# Altium schematic sheet waku-ctl.SchDoc (part 2 of 4)
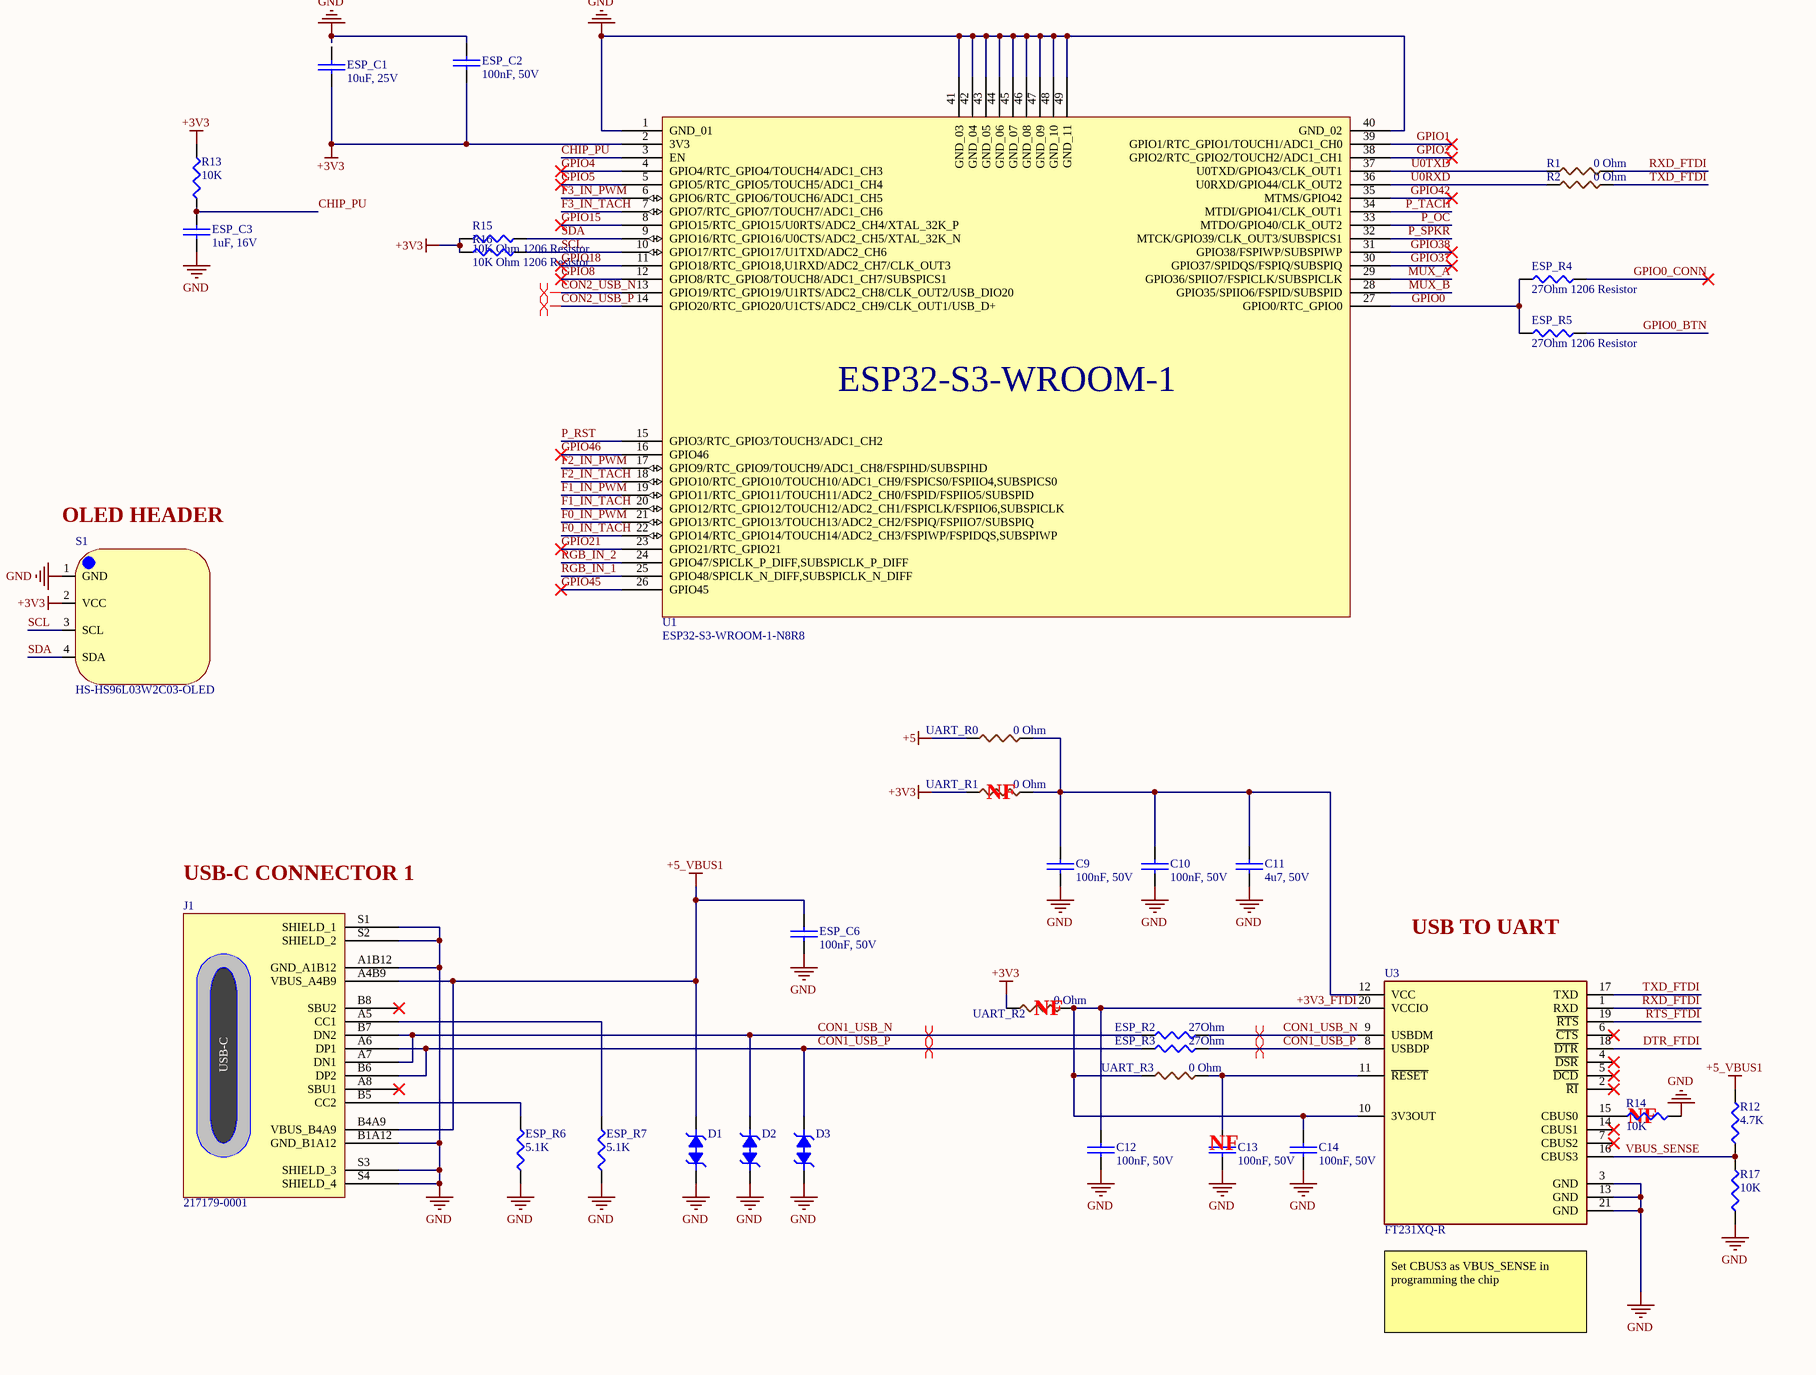
[diagram p4: waku-ctl.SchDoc, bottom right]
## Library data of the parts
C1-C7 C9 C10 C12-C14 ESP_C2 ESP_C4-ESP_C6 ESP_C9 = CL31B104KBCNNNC: CAP CER 0.1UF 50V X7R 1206; Manufacturer: Samsung Electro-Mechanics; Dielectric Material: Ceramic; Tolerance: 10%; Supplier: DigiKey; Supplier Part Number: 1276-1017-1-ND; Manufacturer Part Number: CL31B104KBCNNNC; RoHS: Compliant; Category: Ceramic Capacitors; Stock: 288141; Pricing: 1=0.09, 10=0.05, 50=0.09, 100=0.0301, 500=0.02212, 1000=0.01969 (EUR); Value: 100nF; Case/Package: 1206; Case Code (Imperial): 1206; Case Code (Metric): 3216; China RoHS: Compliant; Contact Plating: Tin; Depth: 1.6mm; Dielectric: X7R; Height: 1mm; Lead Free: Lead Free; Length: 3.2mm; Lifecycle Status: Production; Material: Ceramic; Max Operating Temperature: 125°C; Min Operating Temperature: -55°C; Mounting Technology: Surface Mount; Number of Terminals: 2; Radiation Hardening: No; REACH SVHC: Yes; Schedule B: 8532240020, 8532240020|8532240020, 8532240020|8532240020|8532240020, 8532240020|8532240020|8532240020|8532240020; Thickness: 939.8µm; Voltage: 50V; Voltage Rating: 50V; Voltage Rating (DC): 50V; Width: 1.6mm; ComponentLink1URL: https://datasheet.octopart.com:443/CL31B104KBCNNNC-Samsung-Electro-Mechanics-datasheet-136482609.pdf?src-supplier=IHS; ComponentLink1Description: https://datasheet.octopart.com:443/CL31B104KBCNNNC-Samsung-Electro-Mechanics-datasheet-136482609.pdf?src-supplier=IHS; ComponentLink2URL: https://datasheet.octopart.com/CL31B104KBCNNNC-Samsung-Electro-Mechanics-datasheet-8324245.pdf; ComponentLink2Description: https://datasheet.octopart.com/CL31B104KBCNNNC-Samsung-Electro-Mechanics-datasheet-8324245.pdf; ComponentLink3URL: https://datasheet.octopart.com/CL31B104KBCNNNC-Samsung-Electro-Mechanics-datasheet-97040617.pdf; ComponentLink3Description: https://datasheet.octopart.com/CL31B104KBCNNNC-Samsung-Electro-Mechanics-datasheet-97040617.pdf; ComponentLink4URL: https://datasheet.octopart.com/General-Multilayer-Ceramic-Capacitors-Samsung-datasheet-family-111.pdf; ComponentLink4Description: https://datasheet.octopart.com/General-Multilayer-Ceramic-Capacitors-Samsung-datasheet-family-111.pdf; ComponentLink5URL: https://datasheet.octopart.com:443/CL31B104KBCNNNC-Samsung-Electro-Mechanics-datasheet-149066852.pdf?src-supplier=Future+Electronics; ComponentLink5Description: https://datasheet.octopart.com:443/CL31B104KBCNNNC-Samsung-Electro-Mechanics-datasheet-149066852.pdf?src-supplier=Future+Electronics; ComponentLink6URL: https://datasheet.octopart.com:443/CL31B104KBCNNNC-Samsung-Electro-Mechanics-datasheet-116056824.pdf?src-supplier=Future+Electronics; ComponentLink6Description: https://datasheet.octopart.com:443/CL31B104KBCNNNC-Samsung-Electro-Mechanics-datasheet-116056824.pdf?src-supplier=Future+Electronics; ComponentLink7URL: https://datasheet.octopart.com:443/CL31B104KBCNNNC-Samsung-Electro-Mechanics-datasheet-81462458.pdf?src-supplier=Future+Electronics; ComponentLink7Description: https://datasheet.octopart.com:443/CL31B104KBCNNNC-Samsung-Electro-Mechanics-datasheet-81462458.pdf?src-supplier=Future+Electronics; ComponentLink8URL: https://datasheet.octopart.com:443/CL31B104KBCNNNC-Samsung-datasheet-26669509.pdf?src-supplier=Future+Electronics; ComponentLink8Description: https://datasheet.octopart.com:443/CL31B104KBCNNNC-Samsung-datasheet-26669509.pdf?src-supplier=Future+Electronics; ComponentLink9URL: https://datasheet.octopart.com:443/CL31B104KBCNNNC-Samsung-datasheet-37081328.pdf?src-supplier=Future+Electronics; ComponentLink9Description: https://datasheet.octopart.com:443/CL31B104KBCNNNC-Samsung-datasheet-37081328.pdf?src-supplier=Future+Electronics; ComponentLink10URL: https://datasheet.octopart.com:443/CL31B104KBCNNNC-Samsung-datasheet-8326407.pdf?src-supplier=TME; ComponentLink10Description: https://datasheet.octopart.com:443/CL31B104KBCNNNC-Samsung-datasheet-8326407.pdf?src-supplier=TME; ComponentLink11URL: https://datasheet.octopart.com:443/CL31B104KBCNNNC-Samsung-Electro-Mechanics-datasheet-11721032.pdf?src-supplier=Arrow+Electronics; ComponentLink11Description: https://datasheet.octopart.com:443/CL31B104KBCNNNC-Samsung-Electro-Mechanics-datasheet-11721032.pdf?src-supplier=Arrow+Electronics; ComponentLink12URL: http://sigma.octopart.com:80/rohs_certificate/General-Multilayer-Ceramic-Capacitors-Samsung-family-110.pdf?src-supplier=Compliance+Statements; ComponentLink12Description: http://sigma.octopart.com:80/rohs_certificate/General-Multilayer-Ceramic-Capacitors-Samsung-family-110.pdf?src-supplier=Compliance+Statements; ComponentLink13URL: http://sigma.octopart.com:80/rohs_statement/General-Multilayer-Ceramic-Capacitors-Samsung-family-132.pdf?src-supplier=Compliance+Statements; ComponentLink13Description: http://sigma.octopart.com:80/rohs_statement/General-Multilayer-Ceramic-Capacitors-Samsung-family-132.pdf?src-supplier=Compliance+Statements; ComponentLink14URL: http://sigma.octopart.com:80/reach_statement/General-Multilayer-Ceramic-Capacitors-Samsung-family-133.pdf?src-supplier=Compliance+Statements; ComponentLink14Description: http://sigma.octopart.com:80/reach_statement/General-Multilayer-Ceramic-Capacitors-Samsung-family-133.pdf?src-supplier=Compliance+Statements; LCSC Part Number: C24497
C8 C11 = CL31B475KBHNNNE: CAP CER 4.7UF 50V X7R 1206; Manufacturer: Samsung Electro-Mechanics; Value: 4.7µF; Dielectric Material: Ceramic; Tolerance: 10%; Supplier: DigiKey; Supplier Part Number: 1276-2789-1-ND; Manufacturer Part Number: CL31B475KBHNNNE; RoHS: Compliant; Category: Ceramic Capacitors; Stock: 113871; Pricing: 1=0.29, 10=0.169, 50=0.1226, 100=0.108, 500=0.08468, 1000=0.07734 (USD); Case/Package: 1206; Case Code (Imperial): 1206; Case Code (Metric): 3216; China RoHS: Compliant; Depth: 1.6mm; Dielectric: X7R; Height: 1.8mm; Length: 3.2mm; Lifecycle Status: Production; Material: Ceramic; Max Operating Temperature: 125°C; Min Operating Temperature: -55°C; Mounting Technology: Surface Mount; Number of Terminals: 2; Radiation Hardening: No; REACH SVHC: Yes; Schedule B: 8532240020, 8532240020|8532240020, 8532240020|8532240020|8532240020, 8532240020|8532240020|8532240020|8532240020; Thickness: 1.8034mm; Voltage: 50V; Voltage Rating: 50V; Voltage Rating (DC): 50V; Width: 1.6mm; ComponentLink1URL: https://datasheet.octopart.com:443/CL31B475KBHNNNE-Samsung-Electro-Mechanics-datasheet-182024510.pdf?src-supplier=IHS; ComponentLink1Description: https://datasheet.octopart.com:443/CL31B475KBHNNNE-Samsung-Electro-Mechanics-datasheet-182024510.pdf?src-supplier=IHS; ComponentLink2URL: https://datasheet.octopart.com:443/CL31B475KBHNNNE-Samsung-Electro-Mechanics-datasheet-136482633.pdf?src-supplier=Samsung+SCT; ComponentLink2Description: https://datasheet.octopart.com:443/CL31B475KBHNNNE-Samsung-Electro-Mechanics-datasheet-136482633.pdf?src-supplier=Samsung+SCT; ComponentLink3URL: https://datasheet.octopart.com:443/CL31B475KBHNNNE-Samsung-Electro-Mechanics-datasheet-11792614.pdf?src-supplier=Future+Electronics; ComponentLink3Description: https://datasheet.octopart.com:443/CL31B475KBHNNNE-Samsung-Electro-Mechanics-datasheet-11792614.pdf?src-supplier=Future+Electronics; ComponentLink4URL: https://datasheet.octopart.com:443/CL31B475KBHNNNE-Samsung-Electro-Mechanics-datasheet-149047455.pdf?src-supplier=Future+Electronics; ComponentLink4Description: https://datasheet.octopart.com:443/CL31B475KBHNNNE-Samsung-Electro-Mechanics-datasheet-149047455.pdf?src-supplier=Future+Electronics; ComponentLink5URL: https://datasheet.octopart.com:443/CL31B475KBHNNNE-Samsung-Electro-Mechanics-datasheet-116891132.pdf?src-supplier=Future+Electronics; ComponentLink5Description: https://datasheet.octopart.com:443/CL31B475KBHNNNE-Samsung-Electro-Mechanics-datasheet-116891132.pdf?src-supplier=Future+Electronics; ComponentLink6URL: https://datasheet.octopart.com:443/CL31B475KBHNNNE-Samsung-Electro-Mechanics-datasheet-81462528.pdf?src-supplier=Future+Electronics; ComponentLink6Description: https://datasheet.octopart.com:443/CL31B475KBHNNNE-Samsung-Electro-Mechanics-datasheet-81462528.pdf?src-supplier=Future+Electronics; ComponentLink7URL: https://datasheet.octopart.com:443/CL31B475KBHNNNE-Samsung-datasheet-12557406.pdf?src-supplier=Future+Electronics; ComponentLink7Description: https://datasheet.octopart.com:443/CL31B475KBHNNNE-Samsung-datasheet-12557406.pdf?src-supplier=Future+Electronics; ComponentLink8URL: https://datasheet.octopart.com:443/CL31B475KBHNNNE-Samsung-datasheet-37081328.pdf?src-supplier=Future+Electronics; ComponentLink8Description: https://datasheet.octopart.com:443/CL31B475KBHNNNE-Samsung-datasheet-37081328.pdf?src-supplier=Future+Electronics; ComponentLink9URL: https://datasheet.octopart.com/CL31B475KBHNNNE-Samsung-Electro-Mechanics-datasheet-97040617.pdf; ComponentLink9Description: https://datasheet.octopart.com/CL31B475KBHNNNE-Samsung-Electro-Mechanics-datasheet-97040617.pdf; ComponentLink10URL: https://datasheet.octopart.com/CL31B475KBHNNNE-Samsung-Electro-Mechanics-datasheet-8324245.pdf; ComponentLink10Description: https://datasheet.octopart.com/CL31B475KBHNNNE-Samsung-Electro-Mechanics-datasheet-8324245.pdf; ComponentLink11URL: https://datasheet.octopart.com/General-Multilayer-Ceramic-Capacitors-Samsung-datasheet-family-111.pdf; ComponentLink11Description: https://datasheet.octopart.com/General-Multilayer-Ceramic-Capacitors-Samsung-datasheet-family-111.pdf; ComponentLink12URL: https://datasheet.octopart.com:443/CL31B475KBHNNNE-Samsung-datasheet-59220082.pdf?src-supplier=TME; ComponentLink12Description: https://datasheet.octopart.com:443/CL31B475KBHNNNE-Samsung-datasheet-59220082.pdf?src-supplier=TME; ComponentLink13URL: http://sigma.octopart.com:80/rohs_certificate/General-Multilayer-Ceramic-Capacitors-Samsung-family-110.pdf?src-supplier=Compliance+Statements; ComponentLink13Description: http://sigma.octopart.com:80/rohs_certificate/General-Multilayer-Ceramic-Capacitors-Samsung-family-110.pdf?src-supplier=Compliance+Statements; ComponentLink14URL: http://sigma.octopart.com:80/rohs_statement/General-Multilayer-Ceramic-Capacitors-Samsung-family-132.pdf?src-supplier=Compliance+Statements; ComponentLink14Description: http://sigma.octopart.com:80/rohs_statement/General-Multilayer-Ceramic-Capacitors-Samsung-family-132.pdf?src-supplier=Compliance+Statements; ComponentLink15URL: http://sigma.octopart.com:80/reach_statement/General-Multilayer-Ceramic-Capacitors-Samsung-family-133.pdf?src-supplier=Compliance+Statements; ComponentLink15Description: http://sigma.octopart.com:80/reach_statement/General-Multilayer-Ceramic-Capacitors-Samsung-family-133.pdf?src-supplier=Compliance+Statements; LCSC Part Number: C51205
D1-D6 = ESDL2011PFCT5G: TVS DIODE 1VWM 6VC 2DFN; Manufacturer: onsemi; Manufacturer Lifecycle Status: LIFETIME; Breakdown Voltage: 1.65V; Value: 170fF; Clamping Voltage: 6V; Direction: Bidirectional; Max Breakdown Voltage: 2.3V; Max Junction Temperature (Tj): 150°C; Max Power Dissipation: 313mW; Min Breakdown Voltage: 1.4V; Number of Channels: 1; Peak Pulse Current: 8A; Peak Reverse Current: 500nA; Reverse Standoff Voltage: 1V; Supplier: DigiKey; Supplier Part Number: 488-ESDL2011PFCT5GCT-ND; Manufacturer Part Number: ESDL2011PFCT5G; RoHS: Compliant; Category: TVS Diodes; Stock: 534442; Pricing: 1=0.34, 10=0.207, 100=0.1296, 500=0.09594, 1000=0.08506, 2000=0.07588, 5000=0.06592 (USD); China RoHS: Compliant; Height: 225µm; Lifecycle Status: Production; Max Operating Temperature: 150°C; Min Operating Temperature: -55°C; Number of Elements: 1; Number of Terminals: 2; Polarity: Bidirectional; REACH SVHC: Yes; Schedule B: 8536300000, 8536300000|8536300000|8536300000|8536300000|8536300000|8536300000|8536300000|8536300000|8536300000|8536300000|8536300000|8536300000|8536300000|8536300000|8536300000|8536300000|8536300000|8536300000|8536300000|8536300000|8536300000|8536300000|8536300000|85; ComponentLink1URL: https://datasheet.octopart.com:443/ESDL2011PFCT5G-onsemi-datasheet-180958923.pdf?src-supplier=IHS; ComponentLink1Description: https://datasheet.octopart.com:443/ESDL2011PFCT5G-onsemi-datasheet-180958923.pdf?src-supplier=IHS; ComponentLink2URL: https://datasheet.octopart.com:443/ESDL2011PFCT5G-ON-Semiconductor-datasheet-138706066.pdf?src-supplier=Master+Electronics; ComponentLink2Description: https://datasheet.octopart.com:443/ESDL2011PFCT5G-ON-Semiconductor-datasheet-138706066.pdf?src-supplier=Master+Electronics; ComponentLink3URL: https://sigma.octopart.com:443/138706067/technical_drawing/ON-Semiconductor-ESDL2011PFCT5G.pdf?src-supplier=Upverter; ComponentLink3Description: https://sigma.octopart.com:443/138706067/technical_drawing/ON-Semiconductor-ESDL2011PFCT5G.pdf?src-supplier=Upverter; ComponentLink4URL: https://datasheet.octopart.com:443/ESDL2011PFCT5G-ON-Semiconductor-datasheet-100424875.pdf?src-supplier=onsemi; ComponentLink4Description: https://datasheet.octopart.com:443/ESDL2011PFCT5G-ON-Semiconductor-datasheet-100424875.pdf?src-supplier=onsemi; ComponentLink5URL: https://datasheet.octopart.com:443/ESDL2011PFCT5G-onsemi-datasheet-164667580.pdf?src-supplier=ODG+(Origin+Data+Global); ComponentLink5Description: https://datasheet.octopart.com:443/ESDL2011PFCT5G-onsemi-datasheet-164667580.pdf?src-supplier=ODG+(Origin+Data+Global); ComponentLink6URL: http://sigma.octopart.com:80/150607611/rohs_statement/ON-Semiconductor-ESDL2011PFCT5G.pdf?src-supplier=Compliance+Statements; ComponentLink6Description: http://sigma.octopart.com:80/150607611/rohs_statement/ON-Semiconductor-ESDL2011PFCT5G.pdf?src-supplier=Compliance+Statements; ComponentLink7URL: http://sigma.octopart.com:80/reach_statement/ON-Semiconductor-company-79.pdf?src-supplier=Compliance+Statements; ComponentLink7Description: http://sigma.octopart.com:80/reach_statement/ON-Semiconductor-company-79.pdf?src-supplier=Compliance+Statements; ComponentLink8URL: https://octopart.com:443/opatz8j6/c1?t=2nWe3YPYjfD7Fp_fDiWYl4Qj0p48nXRSprv0hvd4eXUxlb2pIRsLTRO0o0vnPIURXhwSMxlfzTpxr6bjRCXgQYhkmP0xt8DBJuF3PEBDsNwVOeL0_8G7L0ds3laiBcNxz8XFLrQQw30TtMmYZXdPJVCcab4BhRHKEadlCHPdFCsCAOzoZUEiRxcnIpl4UzzHOgphGTQe4n_RCj84ckPOlMyJUhOqqilXphmNJsqVAnmgL6l9ajeiKS5sGE0oHs1jIcBj8O2GBoZ5F-y0LIFgghEX3sUQAyhKCpYFrPgINDftr9200EFYr1g-4bR2-2SFG5wxJ7OCDJB-cN_BTbEh9sea_Mr2reJKPyCjtpPl__nE&src-supplier=Compliance+Statements; ComponentLink8Description: https://octopart.com:443/opatz8j6/c1?t=2nWe3YPYjfD7Fp_fDiWYl4Qj0p48nXRSprv0hvd4eXUxlb2pIRsLTRO0o0vnPIURXhwSMxlfzTpxr6bjRCXgQYhkmP0xt8DBJuF3PEBDsNwVOeL0_8G7L0ds3laiBcNxz8XFLrQQw30TtMmYZXdPJVCcab4BhRHKEadlCHPdFCsCAOzoZUEiRxcnIpl4UzzHOgphGTQe4n_RCj84ckPOlMyJUhOqqilXphmNJsqVAnmgL6l9ajeiKS5sGE0oHs1jIcBj8O2GBoZ5F-y0LIFgghEX3sUQAyhKCpYFrPgINDftr9200EFYr1g-4bR2-2SFG5wxJ7OCDJB-cN_BTbEh9sea_Mr2reJKPyCjtpPl__nE&src-supplier=Compliance+Statements; ComponentLink9URL: https://octopart.com:443/opatz8j6/c1?t=ix1j5btIHuclV0wZh6lHCv91_QWPiW6eH3L8gsHYvYPwKFitj01BBzjtpRgUKfqnH3z0lgjtJB-Eflamec3Yg2SrsYb2xWLuOKwM7n72PefWeurUO7vlHRynaY1BPCnaXo8DCpBU9-gNOm5OyLBO-z2OcOoJk5BsNx1IFeVLyT35mf2yS2trw1TLr7kbhaQ1vg1RolQpQ2NnEzs2Ni0WJCWA3acDq0W2kd55nluwyRBl8HXONpilkhaVI1e7dNCDKd0eNiHwni0Br74kwQrsGTrACt2ZMCvCqOKmJbbpqyX5STitAI7b9CDQLi2Vvjsap-wfiW3XXNuZiyATTFdr7LRpZ6PYeza3MVZb5TJRJ_M&src-supplier=Compliance+Statements; ComponentLink9Description: https://octopart.com:443/opatz8j6/c1?t=ix1j5btIHuclV0wZh6lHCv91_QWPiW6eH3L8gsHYvYPwKFitj01BBzjtpRgUKfqnH3z0lgjtJB-Eflamec3Yg2SrsYb2xWLuOKwM7n72PefWeurUO7vlHRynaY1BPCnaXo8DCpBU9-gNOm5OyLBO-z2OcOoJk5BsNx1IFeVLyT35mf2yS2trw1TLr7kbhaQ1vg1RolQpQ2NnEzs2Ni0WJCWA3acDq0W2kd55nluwyRBl8HXONpilkhaVI1e7dNCDKd0eNiHwni0Br74kwQrsGTrACt2ZMCvCqOKmJbbpqyX5STitAI7b9CDQLi2Vvjsap-wfiW3XXNuZiyATTFdr7LRpZ6PYeza3MVZb5TJRJ_M&src-supplier=Compliance+Statements
D7 = VLMG1500-GS08: LED YLW-GRN 0402 SMD; Manufacturer: Vishay; Color: Green, Yellow; Dominant Wavelength: 571nm; Forward Current: 30mA; Forward Voltage: 2.4V; Lens Color: Clear; Lens Style: Rectangular; Luminous Intensity: 18mcd; Number of Circuits: 1; Power Dissipation: 75mW; Reverse Voltage: 5V; Test Current: 20mA; Viewing Angle: 130°; Supplier: DigiKey; Supplier Part Number: VLMG1500-GS08DKR-ND; Manufacturer Part Number: VLMG1500-GS08; RoHS: Compliant; Category: LEDs; Stock: 249321; Pricing: 1=0.2, 10=0.14, 100=0.2, 500=0.07856, 1000=0.07219 (EUR); Ambient Temperature Range High: 85°C; Case/Package: 0402; Case Code (Imperial): 0402; Case Code (Metric): 1005; Depth: 500µm; Height: 350µm; Illumination Color: Green; Lead Free: Lead Free; Length: 1mm; Lifecycle Status: Production; Max Operating Temperature: 85°C; Min Operating Temperature: -30°C; Mounting Technology: Surface Mount; Number of Elements: 1; Number of LEDs: 1; Pins: 2; Number of Terminals: 2; Packaging: Cut Tape; Peak Wavelength: 571nm; Power Rating: 75mW; Radiation Hardening: No; REACH SVHC: Yes; Schedule B: 8541402000, 8541402000|8541402000|8541402000|8541402000|8541402000; Shape: Rectangular; Terminal Pitch: 675µm; Wavelength: 571nm; Width: 500µm; ComponentLink1URL: https://datasheet.octopart.com:443/VLMG1500-GS08-Vishay-datasheet-181477802.pdf?src-supplier=IHS; ComponentLink1Description: https://datasheet.octopart.com:443/VLMG1500-GS08-Vishay-datasheet-181477802.pdf?src-supplier=IHS; ComponentLink2URL: https://datasheet.octopart.com:443/VLMG1500-GS08-Vishay-datasheet-21227148.pdf?src-supplier=element14+APAC; ComponentLink2Description: https://datasheet.octopart.com:443/VLMG1500-GS08-Vishay-datasheet-21227148.pdf?src-supplier=element14+APAC; ComponentLink3URL: https://datasheet.octopart.com:443/VLMG1500-GS08-Vishay-datasheet-33014519.pdf?src-supplier=element14+APAC; ComponentLink3Description: https://datasheet.octopart.com:443/VLMG1500-GS08-Vishay-datasheet-33014519.pdf?src-supplier=element14+APAC; ComponentLink4URL: https://datasheet.octopart.com:443/VLMG1500-GS08-Vishay-datasheet-62332426.pdf?src-supplier=Newark; ComponentLink4Description: https://datasheet.octopart.com:443/VLMG1500-GS08-Vishay-datasheet-62332426.pdf?src-supplier=Newark; ComponentLink5URL: https://datasheet.octopart.com:443/VLMG1500-GS08-Vishay-datasheet-102762782.pdf?src-supplier=Future+Electronics; ComponentLink5Description: https://datasheet.octopart.com:443/VLMG1500-GS08-Vishay-datasheet-102762782.pdf?src-supplier=Future+Electronics; ComponentLink6URL: https://datasheet.octopart.com:443/VLMG1500-GS08-Vishay-datasheet-68326145.pdf?src-supplier=TME; ComponentLink6Description: https://datasheet.octopart.com:443/VLMG1500-GS08-Vishay-datasheet-68326145.pdf?src-supplier=TME; ComponentLink7URL: http://sigma.octopart.com:80/rohs_statement/Vishay-company-15.pdf?src-supplier=Compliance+Statements; ComponentLink7Description: http://sigma.octopart.com:80/rohs_statement/Vishay-company-15.pdf?src-supplier=Compliance+Statements; LCSC Part Number: C511404
ESP_C1 = CL31B106KAHNNNE: CAP CER 10UF 25V X7R 1206; Manufacturer: Samsung Electro-Mechanics; Value: 10µF; Dielectric Material: Ceramic; Tolerance: 10%; Supplier: DigiKey; Supplier Part Number: 1276-1804-1-ND; Manufacturer Part Number: CL31B106KAHNNNE; RoHS: Compliant; Category: Ceramic Capacitors; Stock: 1958282; Pricing: 1=0.07, 10=0.031 (EUR); Case/Package: 1206; Case Code (Imperial): 1206; Case Code (Metric): 3216; China RoHS: Compliant; Depth: 1.6mm; Dielectric: X7R; Height: 1.8mm; Length: 3.2mm; Lifecycle Status: Production; Material: Ceramic; Max Operating Temperature: 125°C; Min Operating Temperature: -55°C; Mounting Technology: Surface Mount; Number of Terminals: 2; Radiation Hardening: No; REACH SVHC: Yes; Schedule B: 8532240020, 8532240020|8532240020|8532240020|8532240020|8532240020; Thickness: 1.8034mm; Voltage: 25V; Voltage Rating: 25V; Voltage Rating (DC): 25V; Width: 1.6mm; ComponentLink1URL: https://datasheet.octopart.com:443/CL31B106KAHNNNE-Samsung-Electro-Mechanics-datasheet-182024324.pdf?src-supplier=IHS; ComponentLink1Description: https://datasheet.octopart.com:443/CL31B106KAHNNNE-Samsung-Electro-Mechanics-datasheet-182024324.pdf?src-supplier=IHS; ComponentLink2URL: https://datasheet.octopart.com:443/CL31B106KAHNNNE-Samsung-Electro-Mechanics-datasheet-136482614.pdf?src-supplier=Samsung+SCT; ComponentLink2Description: https://datasheet.octopart.com:443/CL31B106KAHNNNE-Samsung-Electro-Mechanics-datasheet-136482614.pdf?src-supplier=Samsung+SCT; ComponentLink3URL: https://datasheet.octopart.com:443/CL31B106KAHNNNE-Samsung-Electro-Mechanics-datasheet-11609088.pdf?src-supplier=Future+Electronics; ComponentLink3Description: https://datasheet.octopart.com:443/CL31B106KAHNNNE-Samsung-Electro-Mechanics-datasheet-11609088.pdf?src-supplier=Future+Electronics; ComponentLink4URL: https://datasheet.octopart.com:443/CL31B106KAHNNNE-Samsung-Electro-Mechanics-datasheet-149066873.pdf?src-supplier=Future+Electronics; ComponentLink4Description: https://datasheet.octopart.com:443/CL31B106KAHNNNE-Samsung-Electro-Mechanics-datasheet-149066873.pdf?src-supplier=Future+Electronics; ComponentLink5URL: https://datasheet.octopart.com:443/CL31B106KAHNNNE-Samsung-Electro-Mechanics-datasheet-116051334.pdf?src-supplier=Future+Electronics; ComponentLink5Description: https://datasheet.octopart.com:443/CL31B106KAHNNNE-Samsung-Electro-Mechanics-datasheet-116051334.pdf?src-supplier=Future+Electronics; ComponentLink6URL: https://datasheet.octopart.com:443/CL31B106KAHNNNE-Samsung-Electro-Mechanics-datasheet-81462475.pdf?src-supplier=Future+Electronics; ComponentLink6Description: https://datasheet.octopart.com:443/CL31B106KAHNNNE-Samsung-Electro-Mechanics-datasheet-81462475.pdf?src-supplier=Future+Electronics; ComponentLink7URL: https://datasheet.octopart.com:443/CL31B106KAHNNNE-Samsung-datasheet-42485257.pdf?src-supplier=Future+Electronics; ComponentLink7Description: https://datasheet.octopart.com:443/CL31B106KAHNNNE-Samsung-datasheet-42485257.pdf?src-supplier=Future+Electronics; ComponentLink8URL: https://datasheet.octopart.com/CL31B106KAHNNNE-Samsung-Electro-Mechanics-datasheet-8324245.pdf; ComponentLink8Description: https://datasheet.octopart.com/CL31B106KAHNNNE-Samsung-Electro-Mechanics-datasheet-8324245.pdf; ComponentLink9URL: https://datasheet.octopart.com/CL31B106KAHNNNE-Samsung-Electro-Mechanics-datasheet-97040617.pdf; ComponentLink9Description: https://datasheet.octopart.com/CL31B106KAHNNNE-Samsung-Electro-Mechanics-datasheet-97040617.pdf; ComponentLink10URL: https://datasheet.octopart.com/General-Multilayer-Ceramic-Capacitors-Samsung-datasheet-family-111.pdf; ComponentLink10Description: https://datasheet.octopart.com/General-Multilayer-Ceramic-Capacitors-Samsung-datasheet-family-111.pdf; ComponentLink11URL: https://datasheet.octopart.com:443/CL31B106KAHNNNE-Samsung-datasheet-59220082.pdf?src-supplier=TME; ComponentLink11Description: https://datasheet.octopart.com:443/CL31B106KAHNNNE-Samsung-datasheet-59220082.pdf?src-supplier=TME; ComponentLink12URL: http://sigma.octopart.com:80/rohs_certificate/General-Multilayer-Ceramic-Capacitors-Samsung-family-110.pdf?src-supplier=Compliance+Statements; ComponentLink12Description: http://sigma.octopart.com:80/rohs_certificate/General-Multilayer-Ceramic-Capacitors-Samsung-family-110.pdf?src-supplier=Compliance+Statements; ComponentLink13URL: http://sigma.octopart.com:80/rohs_statement/General-Multilayer-Ceramic-Capacitors-Samsung-family-132.pdf?src-supplier=Compliance+Statements; ComponentLink13Description: http://sigma.octopart.com:80/rohs_statement/General-Multilayer-Ceramic-Capacitors-Samsung-family-132.pdf?src-supplier=Compliance+Statements; ComponentLink14URL: http://sigma.octopart.com:80/reach_statement/General-Multilayer-Ceramic-Capacitors-Samsung-family-133.pdf?src-supplier=Compliance+Statements; ComponentLink14Description: http://sigma.octopart.com:80/reach_statement/General-Multilayer-Ceramic-Capacitors-Samsung-family-133.pdf?src-supplier=Compliance+Statements; LCSC Part Number: C14860
ESP_C3 ESP_C7 ESP_C8 = CL31B105KOFNNNE: CAP CER 1UF 16V X7R 1206; Manufacturer: Samsung Electro-Mechanics; Value: 1µF; Dielectric Material: Ceramic; Tolerance: 10%; Supplier: DigiKey; Supplier Part Number: 1276-1783-1-ND; Manufacturer Part Number: CL31B105KOFNNNE; RoHS: Compliant; Category: Ceramic Capacitors; Stock: 29309; Pricing: 1=0.1, 10=0.057, 50=0.1, 100=0.0345, 500=0.02562, 1000=0.02288 (EUR); Case/Package: 1206; Case Code (Imperial): 1206; Case Code (Metric): 3216; China RoHS: Compliant; Contact Plating: Tin; Depth: 1.6mm; Dielectric: X7R; Height: 1.25mm; Lead Free: Lead Free; Length: 3.2mm; Lifecycle Status: Production; Material: Ceramic; Max Operating Temperature: 125°C; Min Operating Temperature: -55°C; Mounting Technology: Surface Mount; Number of Terminals: 2; Radiation Hardening: No; REACH SVHC: Yes; Schedule B: 8532240020, 8532240020|8532240020, 8532240020|8532240020|8532240020, 8532240020|8532240020|8532240020|8532240020; Thickness: 1.397mm; Voltage: 16V; Voltage Rating: 16V; Voltage Rating (DC): 16V; Width: 1.6mm; ComponentLink1URL: https://datasheet.octopart.com:443/CL31B105KOFNNNE-Samsung-Electro-Mechanics-datasheet-137745094.pdf?src-supplier=Newark; ComponentLink1Description: https://datasheet.octopart.com:443/CL31B105KOFNNNE-Samsung-Electro-Mechanics-datasheet-137745094.pdf?src-supplier=Newark; ComponentLink2URL: https://datasheet.octopart.com/CL31B105KOFNNNE-Samsung-Electro-Mechanics-datasheet-8324245.pdf; ComponentLink2Description: https://datasheet.octopart.com/CL31B105KOFNNNE-Samsung-Electro-Mechanics-datasheet-8324245.pdf; ComponentLink3URL: https://datasheet.octopart.com/CL31B105KOFNNNE-Samsung-Electro-Mechanics-datasheet-97040617.pdf; ComponentLink3Description: https://datasheet.octopart.com/CL31B105KOFNNNE-Samsung-Electro-Mechanics-datasheet-97040617.pdf; ComponentLink4URL: https://datasheet.octopart.com:443/CL31B105KOFNNNE-Samsung-Electro-Mechanics-datasheet-149066871.pdf?src-supplier=Future+Electronics; ComponentLink4Description: https://datasheet.octopart.com:443/CL31B105KOFNNNE-Samsung-Electro-Mechanics-datasheet-149066871.pdf?src-supplier=Future+Electronics; ComponentLink5URL: https://datasheet.octopart.com:443/CL31B105KOFNNNE-Samsung-Electro-Mechanics-datasheet-116891099.pdf?src-supplier=Future+Electronics; ComponentLink5Description: https://datasheet.octopart.com:443/CL31B105KOFNNNE-Samsung-Electro-Mechanics-datasheet-116891099.pdf?src-supplier=Future+Electronics; ComponentLink6URL: https://datasheet.octopart.com:443/CL31B105KOFNNNE-Samsung-Electro-Mechanics-datasheet-81462472.pdf?src-supplier=Future+Electronics; ComponentLink6Description: https://datasheet.octopart.com:443/CL31B105KOFNNNE-Samsung-Electro-Mechanics-datasheet-81462472.pdf?src-supplier=Future+Electronics; ComponentLink7URL: https://datasheet.octopart.com:443/CL31B105KOFNNNE-Samsung-datasheet-26669518.pdf?src-supplier=Future+Electronics; ComponentLink7Description: https://datasheet.octopart.com:443/CL31B105KOFNNNE-Samsung-datasheet-26669518.pdf?src-supplier=Future+Electronics; ComponentLink8URL: https://datasheet.octopart.com:443/CL31B105KOFNNNE-Samsung-datasheet-37081328.pdf?src-supplier=Future+Electronics; ComponentLink8Description: https://datasheet.octopart.com:443/CL31B105KOFNNNE-Samsung-datasheet-37081328.pdf?src-supplier=Future+Electronics; ComponentLink9URL: https://datasheet.octopart.com:443/CL31B105KOFNNNE-Samsung-datasheet-59220082.pdf?src-supplier=TME; ComponentLink9Description: https://datasheet.octopart.com:443/CL31B105KOFNNNE-Samsung-datasheet-59220082.pdf?src-supplier=TME; LCSC Part Number: C318771
ESP_R2-ESP_R5 = RT1206FRE0727RL: RES 27 OHM 1% 1/4W 1206; Manufacturer: Yageo Group; Power Dissipation: 250mW; Value: 27Ω; Temperature Coefficient: 50ppm/°C; Voltage Rating: 200V; Supplier: DigiKey; Supplier Part Number: 13-RT1206FRE0727RLCT-ND; Manufacturer Part Number: RT1206FRE0727RL; RoHS: Compliant; Category: Chip SMD Resistors; Stock: 2502; Pricing: 1=0.1, 10=0.038, 25=0.0372, 50=0.0368, 100=0.0326, 250=0.02856, 500=0.0177 (USD); Case/Package: 1206; Case Code (Imperial): 1206; Case Code (Metric): 3216; China RoHS: Non-Compliant; Composition: Thin Film; Contact Plating: Tin; Height: 550µm; Lead Free: Lead Free; Length: 3.1mm; Lifecycle Status: Production; Max Operating Temperature: 155°C; Min Operating Temperature: -55°C; Mounting Technology: Surface Mount; Number of Terminals: 2; Power Rating: 250mW; Radiation Hardening: No; REACH SVHC: Yes; Termination: SMD/SMT; Tolerance: 1%; Voltage Rating (DC): 200V; Weight: 16.187578mg; Width: 1.6mm; Working Voltage: 200V; ComponentLink1URL: https://datasheet.octopart.com:443/RT1206FRE0727RL-Yageo-datasheet-176402239.pdf?src-supplier=IHS; ComponentLink1Description: https://datasheet.octopart.com:443/RT1206FRE0727RL-Yageo-datasheet-176402239.pdf?src-supplier=IHS; ComponentLink2URL: https://datasheet.octopart.com:443/RT1206FRE0727RL-Yageo-datasheet-96443642.pdf?src-supplier=Upverter; ComponentLink2Description: https://datasheet.octopart.com:443/RT1206FRE0727RL-Yageo-datasheet-96443642.pdf?src-supplier=Upverter; ComponentLink3URL: https://datasheet.octopart.com:443/RT1206FRE0727RL-Yageo-datasheet-169971040.pdf?src-supplier=Future+Electronics; ComponentLink3Description: https://datasheet.octopart.com:443/RT1206FRE0727RL-Yageo-datasheet-169971040.pdf?src-supplier=Future+Electronics; ComponentLink4URL: https://datasheet.octopart.com:443/RT1206FRE0727RL-Yageo-datasheet-166250672.pdf?src-supplier=Future+Electronics; ComponentLink4Description: https://datasheet.octopart.com:443/RT1206FRE0727RL-Yageo-datasheet-166250672.pdf?src-supplier=Future+Electronics; ComponentLink5URL: https://datasheet.octopart.com:443/RT1206FRE0727RL-Yageo-datasheet-137700930.pdf?src-supplier=Future+Electronics; ComponentLink5Description: https://datasheet.octopart.com:443/RT1206FRE0727RL-Yageo-datasheet-137700930.pdf?src-supplier=Future+Electronics; ComponentLink6URL: https://datasheet.octopart.com/RT1206FRE0727RL-Yageo-datasheet-86813807.pdf; ComponentLink6Description: https://datasheet.octopart.com/RT1206FRE0727RL-Yageo-datasheet-86813807.pdf; ComponentLink7URL: http://sigma.octopart.com:80/rohs_statement/Yageo-company-2.pdf?src-supplier=Compliance+Statements; ComponentLink7Description: http://sigma.octopart.com:80/rohs_statement/Yageo-company-2.pdf?src-supplier=Compliance+Statements; ComponentLink8URL: http://sigma.octopart.com:80/conflict_mineral_statement/Yageo-company-3.pdf?src-supplier=Compliance+Statements; ComponentLink8Description: http://sigma.octopart.com:80/conflict_mineral_statement/Yageo-company-3.pdf?src-supplier=Compliance+Statements; LCSC Part Number: C724027
ESP_R6-ESP_R9 = RC1206FR-075K1L: RES 5.1K OHM 1% 1/4W 1206; Manufacturer: Yageo Group; Max Power Dissipation: 250mW; Value: 5.1kΩ; Temperature Coefficient: 100ppm/°C; Voltage Rating: 200V; Supplier: DigiKey; Supplier Part Number: 311-5.10KFRCT-ND; Manufacturer Part Number: RC1206FR-075K1L; RoHS: Compliant; Category: Chip SMD Resistors; Stock: 24081; Pricing: 1=0.1, 10=0.017, 25=0.0148, 50=0.0102 (USD); Case/Package: 1206; Case Code (Imperial): 1206; Case Code (Metric): 3216; China RoHS: Non-Compliant; Composition: Thick Film; Depth: 1.6mm; Height: 550µm; Lead Free: Lead Free; Length: 3.1mm; Lifecycle Status: Production; Max Operating Temperature: 155°C; Military Standard: Not; Min Operating Temperature: -55°C; Mounting Technology: Surface Mount; Number of Terminals: 2; Number of Terminations: 2; Packaging: Tape & Reel; Power Dissipation: 250mW; Power Rating: 250mW; REACH SVHC: Yes; Schedule B: 8533210045, 8533210045|8533210045|8533210045|8533210045|8533210045|8533210045|8533210045|8533210045|8533210045|8533210045|8533210045|8533210045|8533210045|8533210045|8533210045|8533210045|8533210045|8533210045|8533210045|8533210045, 8533210045|8533210045|8533210045|8533210045|8533210045|8533210045|8533210045|8533210045|8533210045|8533210045|8533210045|8533210045|8533210045|8533210045|8533210045|8533210045|8533210045|8533210045|8533210045|8533210045|8533210045, 8533210045|8533210045|8533210045|8533210045|8533210045|8533210045|8533210045|8533210045|8533210045|8533210045|8533210045|8533210045|8533210045|8533210045|8533210045|8533210045|8533210045|8533210045|8533210045|8533210045|8533210045|8533210045; Termination: SMD/SMT; Tolerance: 1%; Voltage Rating (DC): 200V; Width: 1.6mm; Working Voltage: 200V; ComponentLink1URL: https://datasheet.octopart.com:443/RC1206FR-075K1L-Yageo-datasheet-175887523.pdf?src-supplier=Farnell; ComponentLink1Description: https://datasheet.octopart.com:443/RC1206FR-075K1L-Yageo-datasheet-175887523.pdf?src-supplier=Farnell; ComponentLink2URL: https://datasheet.octopart.com:443/RC1206FR-075K1L-Yageo-datasheet-103092701.pdf?src-supplier=Upverter; ComponentLink2Description: https://datasheet.octopart.com:443/RC1206FR-075K1L-Yageo-datasheet-103092701.pdf?src-supplier=Upverter; ComponentLink3URL: https://datasheet.octopart.com:443/RC1206FR-075K1L-Yageo-datasheet-8359522.pdf?src-supplier=Burklin+Elektronik; ComponentLink3Description: https://datasheet.octopart.com:443/RC1206FR-075K1L-Yageo-datasheet-8359522.pdf?src-supplier=Burklin+Elektronik; ComponentLink4URL: https://datasheet.octopart.com:443/RC1206FR-075K1L-Yageo-datasheet-164759695.pdf?src-supplier=Future+Electronics; ComponentLink4Description: https://datasheet.octopart.com:443/RC1206FR-075K1L-Yageo-datasheet-164759695.pdf?src-supplier=Future+Electronics; ComponentLink5URL: https://datasheet.octopart.com:443/RC1206FR-075K1L-Yageo-datasheet-137700087.pdf?src-supplier=Future+Electronics; ComponentLink5Description: https://datasheet.octopart.com:443/RC1206FR-075K1L-Yageo-datasheet-137700087.pdf?src-supplier=Future+Electronics; ComponentLink6URL: https://datasheet.octopart.com:443/RC1206FR-075K1L-Yageo-datasheet-27233761.pdf?src-supplier=Future+Electronics; ComponentLink6Description: https://datasheet.octopart.com:443/RC1206FR-075K1L-Yageo-datasheet-27233761.pdf?src-supplier=Future+Electronics; ComponentLink7URL: https://datasheet.octopart.com:443/RC1206FR-075K1L-Yageo-datasheet-13032847.pdf?src-supplier=Future+Electronics; ComponentLink7Description: https://datasheet.octopart.com:443/RC1206FR-075K1L-Yageo-datasheet-13032847.pdf?src-supplier=Future+Electronics; ComponentLink8URL: https://datasheet.octopart.com:443/RC1206FR-075K1L-Yageo-datasheet-148775077.pdf?src-supplier=JRH+Electronics; ComponentLink8Description: https://datasheet.octopart.com:443/RC1206FR-075K1L-Yageo-datasheet-148775077.pdf?src-supplier=JRH+Electronics; ComponentLink9URL: https://datasheet.octopart.com:443/RC1206FR-075K1L-Yageo-datasheet-79472498.pdf?src-supplier=Megastar; ComponentLink9Description: https://datasheet.octopart.com:443/RC1206FR-075K1L-Yageo-datasheet-79472498.pdf?src-supplier=Megastar; ComponentLink10URL: https://datasheet.octopart.com/RC1206FR-075K1L-Yageo-datasheet-73766026.pdf; ComponentLink10Description: https://datasheet.octopart.com/RC1206FR-075K1L-Yageo-datasheet-73766026.pdf; ComponentLink11URL: https://datasheet.octopart.com:443/RC1206FR-075K1L-Yageo-datasheet-118639.pdf?src-supplier=DigiKey; ComponentLink11Description: https://datasheet.octopart.com:443/RC1206FR-075K1L-Yageo-datasheet-118639.pdf?src-supplier=DigiKey; ComponentLink12URL: http://sigma.octopart.com:80/rohs_statement/Yageo-company-2.pdf?src-supplier=Compliance+Statements; ComponentLink12Description: http://sigma.octopart.com:80/rohs_statement/Yageo-company-2.pdf?src-supplier=Compliance+Statements; ComponentLink13URL: http://sigma.octopart.com:80/conflict_mineral_statement/Yageo-company-3.pdf?src-supplier=Compliance+Statements; ComponentLink13Description: http://sigma.octopart.com:80/conflict_mineral_statement/Yageo-company-3.pdf?src-supplier=Compliance+Statements; LCSC Part Number: C163372
J1 J2 = 217179-0001: CONN RCP USB2.0 TYP C 24P SMD RA; Manufacturer: Molex; Contact Resistance: 50mΩ; Current Rating: 1.25A; Dielectric Material: Polyamide; Gender: Receptacle; Insulation Resistance: 100MΩ; Number of Contacts: 16; Number of Ports: 1; Voltage Rating: 30V; Supplier: DigiKey; Supplier Part Number: 900-2171790001CT-ND; Manufacturer Part Number: 217179-0001; RoHS: Compliant; Category: USB Connectors; Stock: 5092; Pricing: 1=0.83, 10=0.704, 25=0.6596, 50=0.628, 100=0.598, 250=0.56052, 500=0.53374, 1200=0.50175, 2400=0.4778, 3600=0.46433, 6000=0.4479, 8400=0.4374, 12000=0.42654 (USD); Contact Gender: Female; Contact Material: Gold, Nickel; Height: 3.36mm; Lifecycle Status: Production; Max Operating Temperature: 85°C; Min Operating Temperature: -40°C; Pins: 16; Number of Rows: 1; REACH SVHC: Yes; Shell Finish: Nickel; Shell Material: Stainless Steel; Terminal Pitch: 500µm; USB Standard: USB 2.0; ComponentLink1URL: https://datasheet.octopart.com:443/217179-0001-Molex-datasheet-158871109.pdf?src-supplier=ODG+(Origin+Data+Global); ComponentLink1Description: https://datasheet.octopart.com:443/217179-0001-Molex-datasheet-158871109.pdf?src-supplier=ODG+(Origin+Data+Global); ComponentLink2URL: https://sigma.octopart.com:443/158871110/technical_drawing/Molex-217179-0001.pdf?src-supplier=Upverter; ComponentLink2Description: https://sigma.octopart.com:443/158871110/technical_drawing/Molex-217179-0001.pdf?src-supplier=Upverter; ComponentLink3URL: https://datasheet.octopart.com:443/217179-0001-Molex-datasheet-164573281.pdf?src-supplier=RS+(Formerly+Allied+Electronics); ComponentLink3Description: https://datasheet.octopart.com:443/217179-0001-Molex-datasheet-164573281.pdf?src-supplier=RS+(Formerly+Allied+Electronics); ComponentLink4URL: http://sigma.octopart.com:80/conflict_mineral_statement/Molex-company-72.pdf?src-supplier=Compliance+Statements; ComponentLink4Description: http://sigma.octopart.com:80/conflict_mineral_statement/Molex-company-72.pdf?src-supplier=Compliance+Statements; ComponentLink5URL: http://sigma.octopart.com:80/rohs_statement/Molex-company-73.pdf?src-supplier=Compliance+Statements; ComponentLink5Description: http://sigma.octopart.com:80/rohs_statement/Molex-company-73.pdf?src-supplier=Compliance+Statements; ComponentLink6URL: http://sigma.octopart.com:80/reach_statement/Molex-company-74.pdf?src-supplier=Compliance+Statements; ComponentLink6Description: http://sigma.octopart.com:80/reach_statement/Molex-company-74.pdf?src-supplier=Compliance+Statements; LCSC Part Number: C3197684
J3 = GRPB031VWVN-RC: CONN HEADER VERT 3POS 1.27MM; Manufacturer: Sullins; Connector Type: Male Pin; Contact Resistance: 20mΩ; Current Rating: 1A; Dielectric Material: Polyamide; Insulation Resistance: 5GΩ; Number of Positions: 3; Supplier: DigiKey; Supplier Part Number: S9014E-03-ND; Manufacturer Part Number: GRPB031VWVN-RC; RoHS: Compliant; Category: Card Edge Connectors; Stock: 52349; Pricing: 1=0.19, 10=0.164, 100=0.1391, 500=0.12416, 1000=0.11822, 5000=0.10552, 10000=0.10048 (USD); Contact Gender: Male; Contact Mating Length: 2.9972mm; Contact Plating: Gold; Lead Free: Lead Free; Lifecycle Status: Production; Max Operating Temperature: 105°C; Min Operating Temperature: -40°C; Mounting Technology: Through Hole; Pins: 3; Number of Rows: 1; Packaging: Bulk; Pitch: 1.27mm; REACH SVHC: Yes; Terminal Pitch: 1.27mm; Termination: Solder; ComponentLink1URL: https://datasheet.octopart.com:443/GRPB031VWVN-RC-Sullins-datasheet-181250435.pdf?src-supplier=IHS; ComponentLink1Description: https://datasheet.octopart.com:443/GRPB031VWVN-RC-Sullins-datasheet-181250435.pdf?src-supplier=IHS; ComponentLink2URL: https://datasheet.octopart.com:443/GRPB031VWVN-RC-Sullins-datasheet-138898432.pdf?src-supplier=ODG+(Origin+Data+Global); ComponentLink2Description: https://datasheet.octopart.com:443/GRPB031VWVN-RC-Sullins-datasheet-138898432.pdf?src-supplier=ODG+(Origin+Data+Global); ComponentLink3URL: https://datasheet.octopart.com:443/GRPB031VWVN-RC-Sullins-datasheet-34148777.pdf?src-supplier=Future+Electronics; ComponentLink3Description: https://datasheet.octopart.com:443/GRPB031VWVN-RC-Sullins-datasheet-34148777.pdf?src-supplier=Future+Electronics; ComponentLink4URL: https://datasheet.octopart.com:443/GRPB031VWVN-RC-Sullins-datasheet-12514290.pdf?src-supplier=Future+Electronics; ComponentLink4Description: https://datasheet.octopart.com:443/GRPB031VWVN-RC-Sullins-datasheet-12514290.pdf?src-supplier=Future+Electronics; LCSC Part Number: C41427056
J4 = GRPB021VWVN-RC: CONN HEADER VERT 2POS 1.27MM; Manufacturer: Sullins; Connector Type: Male Pin; Contact Resistance: 20mΩ; Current Rating: 1A; Dielectric Material: Polyamide; Insulation Resistance: 5GΩ; Number of Contacts: 2; Supplier: DigiKey; Supplier Part Number: S9014E-02-ND; Manufacturer Part Number: GRPB021VWVN-RC; RoHS: Compliant; Category: Headers and Wire Housings; Stock: 61532; Pricing: 1=0.14, 10=0.118, 100=0.14, 500=0.0891, 1000=0.08485, 5000=0.07573, 10000=0.07211 (EUR); Contact Gender: Male; Contact Material: Brass; Contact Mating Length: 2.9972mm; Contact Plating: Gold; Height: 4.4mm; Lead Free: Lead Free; Lifecycle Status: Production; Max Operating Temperature: 105°C; Min Operating Temperature: -40°C; Mounting Technology: Through Hole; Pins: 2; Number of Positions: 2; Number of Rows: 1; Packaging: Bulk; Pitch: 1.27mm; REACH SVHC: Yes; Terminal Pitch: 1.27mm; Termination: Solder; ComponentLink1URL: https://datasheet.octopart.com:443/GRPB021VWVN-RC-Sullins-datasheet-138898432.pdf?src-supplier=IHS; ComponentLink1Description: https://datasheet.octopart.com:443/GRPB021VWVN-RC-Sullins-datasheet-138898432.pdf?src-supplier=IHS; ComponentLink2URL: https://sigma.octopart.com:443/141423368/technical_drawing/Sullins-GRPB021VWVN-RC.pdf?src-supplier=Upverter; ComponentLink2Description: https://sigma.octopart.com:443/141423368/technical_drawing/Sullins-GRPB021VWVN-RC.pdf?src-supplier=Upverter; ComponentLink3URL: https://datasheet.octopart.com:443/GRPB021VWVN-RC-Sullins-datasheet-34148777.pdf?src-supplier=Future+Electronics; ComponentLink3Description: https://datasheet.octopart.com:443/GRPB021VWVN-RC-Sullins-datasheet-34148777.pdf?src-supplier=Future+Electronics; ComponentLink4URL: https://datasheet.octopart.com:443/GRPB021VWVN-RC-Sullins-datasheet-12514290.pdf?src-supplier=Future+Electronics; ComponentLink4Description: https://datasheet.octopart.com:443/GRPB021VWVN-RC-Sullins-datasheet-12514290.pdf?src-supplier=Future+Electronics; LCSC Part Number: C41427055
J5-J7 = 22-28-8020: CONN HEADER R/A 2POS 2.54MM; Manufacturer: Molex; Manufacturer Lifecycle Status: ACTIVE; Contact Resistance: 10mΩ; Current Rating: 4A; Gender: Male; Glow Wire Compliant: Non-compliant; Insulation Resistance: 1GΩ; Max Voltage Rating (DC): 250.25kV; Number of Circuits: 2; Operating Force: 4.8928N; Plating: Tin; Plating Thickness: 2.54µm; Voltage Rating: 500V; Voltage Rating (DC): 250V; Supplier: DigiKey; Supplier Part Number: WM50013-02-ND; Manufacturer Part Number: 22-28-8020; RoHS: Compliant; Category: Headers and Wire Housings; Stock: 771; Pricing: 1=0.38, 10=0.318, 100=0.38, 500=0.24124, 1000=0.22972, 5000=0.20505, 10000=0.19526 (EUR); China RoHS: Compliant; Color: Black; Contact Gender: Male; Contact Material: Nickel, Tin; Contact Plating: Tin; Country of Origin: US; Flammability Rating: UL94 V-0; Height: 2.74mm; Housing Color: Black; Housing Material: Thermoplastic; Lead Free: Lead Free; Lead Pitch: 2.54mm; Lifecycle Status: Production; Max Operating Temperature: 80°C; Min Operating Temperature: -40°C; Mounting Technology: Through Hole; Number of Contacts: 2; Pins: 2; Number of Positions: 2; Number of Rows: 1; Orientation: Right Angle; Packaging: Bulk; Pitch: 2.54mm; Radiation Hardening: No; REACH SVHC: Yes; Terminal Pitch: 2.54mm; Termination: Through Hole; ComponentLink1URL: https://datasheet.octopart.com:443/22-28-8020-Molex-datasheet-158885819.pdf?src-supplier=Newark; ComponentLink1Description: https://datasheet.octopart.com:443/22-28-8020-Molex-datasheet-158885819.pdf?src-supplier=Newark; ComponentLink2URL: https://datasheet.octopart.com:443/22-28-8020-Molex-datasheet-16301288.pdf?src-supplier=Molex; ComponentLink2Description: https://datasheet.octopart.com:443/22-28-8020-Molex-datasheet-16301288.pdf?src-supplier=Molex; ComponentLink3URL: https://sigma.octopart.com:443/12577388/technical_drawing/Molex-22-28-8020.pdf?src-supplier=Molex; ComponentLink3Description: https://sigma.octopart.com:443/12577388/technical_drawing/Molex-22-28-8020.pdf?src-supplier=Molex; ComponentLink4URL: https://datasheet.octopart.com:443/022288020-Molex-datasheet-8335722.pdf?src-supplier=Molex; ComponentLink4Description: https://datasheet.octopart.com:443/022288020-Molex-datasheet-8335722.pdf?src-supplier=Molex; ComponentLink5URL: https://datasheet.octopart.com:443/22-28-8020-Molex-datasheet-77519799.pdf?src-supplier=element14+APAC; ComponentLink5Description: https://datasheet.octopart.com:443/22-28-8020-Molex-datasheet-77519799.pdf?src-supplier=element14+APAC; ComponentLink6URL: https://datasheet.octopart.com:443/22-28-8020-Molex-datasheet-21206989.pdf?src-supplier=element14+APAC; ComponentLink6Description: https://datasheet.octopart.com:443/22-28-8020-Molex-datasheet-21206989.pdf?src-supplier=element14+APAC; ComponentLink7URL: https://datasheet.octopart.com:443/22-28-8020-Molex-datasheet-66628180.pdf?src-supplier=element14+APAC; ComponentLink7Description: https://datasheet.octopart.com:443/22-28-8020-Molex-datasheet-66628180.pdf?src-supplier=element14+APAC; ComponentLink8URL: https://datasheet.octopart.com:443/22-28-8020-Molex-datasheet-154747351.pdf?src-supplier=Master+Electronics; ComponentLink8Description: https://datasheet.octopart.com:443/22-28-8020-Molex-datasheet-154747351.pdf?src-supplier=Master+Electronics; ComponentLink9URL: https://datasheet.octopart.com:443/22-28-8020-Molex-datasheet-140181320.pdf?src-supplier=RS+(Formerly+Allied+Electronics); ComponentLink9Description: https://datasheet.octopart.com:443/22-28-8020-Molex-datasheet-140181320.pdf?src-supplier=RS+(Formerly+Allied+Electronics); ComponentLink10URL: https://datasheet.octopart.com:443/22-28-8020-Molex-datasheet-120146384.pdf?src-supplier=RS+(Formerly+Allied+Electronics); ComponentLink10Description: https://datasheet.octopart.com:443/22-28-8020-Molex-datasheet-120146384.pdf?src-supplier=RS+(Formerly+Allied+Electronics); ComponentLink11URL: https://datasheet.octopart.com:443/22-28-8020-Molex-datasheet-62280231.pdf?src-supplier=Electro+Sonic; ComponentLink11Description: https://datasheet.octopart.com:443/22-28-8020-Molex-datasheet-62280231.pdf?src-supplier=Electro+Sonic; ComponentLink12URL: https://datasheet.octopart.com:443/22-28-8020-Molex-datasheet-42201833.pdf?src-supplier=Electro+Sonic; ComponentLink12Description: https://datasheet.octopart.com:443/22-28-8020-Molex-datasheet-42201833.pdf?src-supplier=Electro+Sonic; ComponentLink13URL: https://datasheet.octopart.com:443/22-28-8020-Molex-datasheet-132467.pdf?src-supplier=DigiKey; ComponentLink13Description: https://datasheet.octopart.com:443/22-28-8020-Molex-datasheet-132467.pdf?src-supplier=DigiKey; ComponentLink14URL: http://sigma.octopart.com:80/16301292/rohs_statement/Molex-22-28-8020.pdf?src-supplier=Compliance+Statements; ComponentLink14Description: http://sigma.octopart.com:80/16301292/rohs_statement/Molex-22-28-8020.pdf?src-supplier=Compliance+Statements; ComponentLink15URL: http://sigma.octopart.com:80/conflict_mineral_statement/Molex-company-72.pdf?src-supplier=Compliance+Statements; ComponentLink15Description: http://sigma.octopart.com:80/conflict_mineral_statement/Molex-company-72.pdf?src-supplier=Compliance+Statements; ComponentLink16URL: http://sigma.octopart.com:80/rohs_statement/Molex-company-73.pdf?src-supplier=Compliance+Statements; ComponentLink16Description: http://sigma.octopart.com:80/rohs_statement/Molex-company-73.pdf?src-supplier=Compliance+Statements; ComponentLink17URL: http://sigma.octopart.com:80/reach_statement/Molex-company-74.pdf?src-supplier=Compliance+Statements; ComponentLink17Description: http://sigma.octopart.com:80/reach_statement/Molex-company-74.pdf?src-supplier=Compliance+Statements